# EAGLE design STX3NoAnt (EAGLE 6.5.0)
STX3 Satellite Transmitter Breakout Board This board allows for direct UART interface with the STX3 module through the standard 6-pin header. The transmitter corresponds using the standard AT command set.
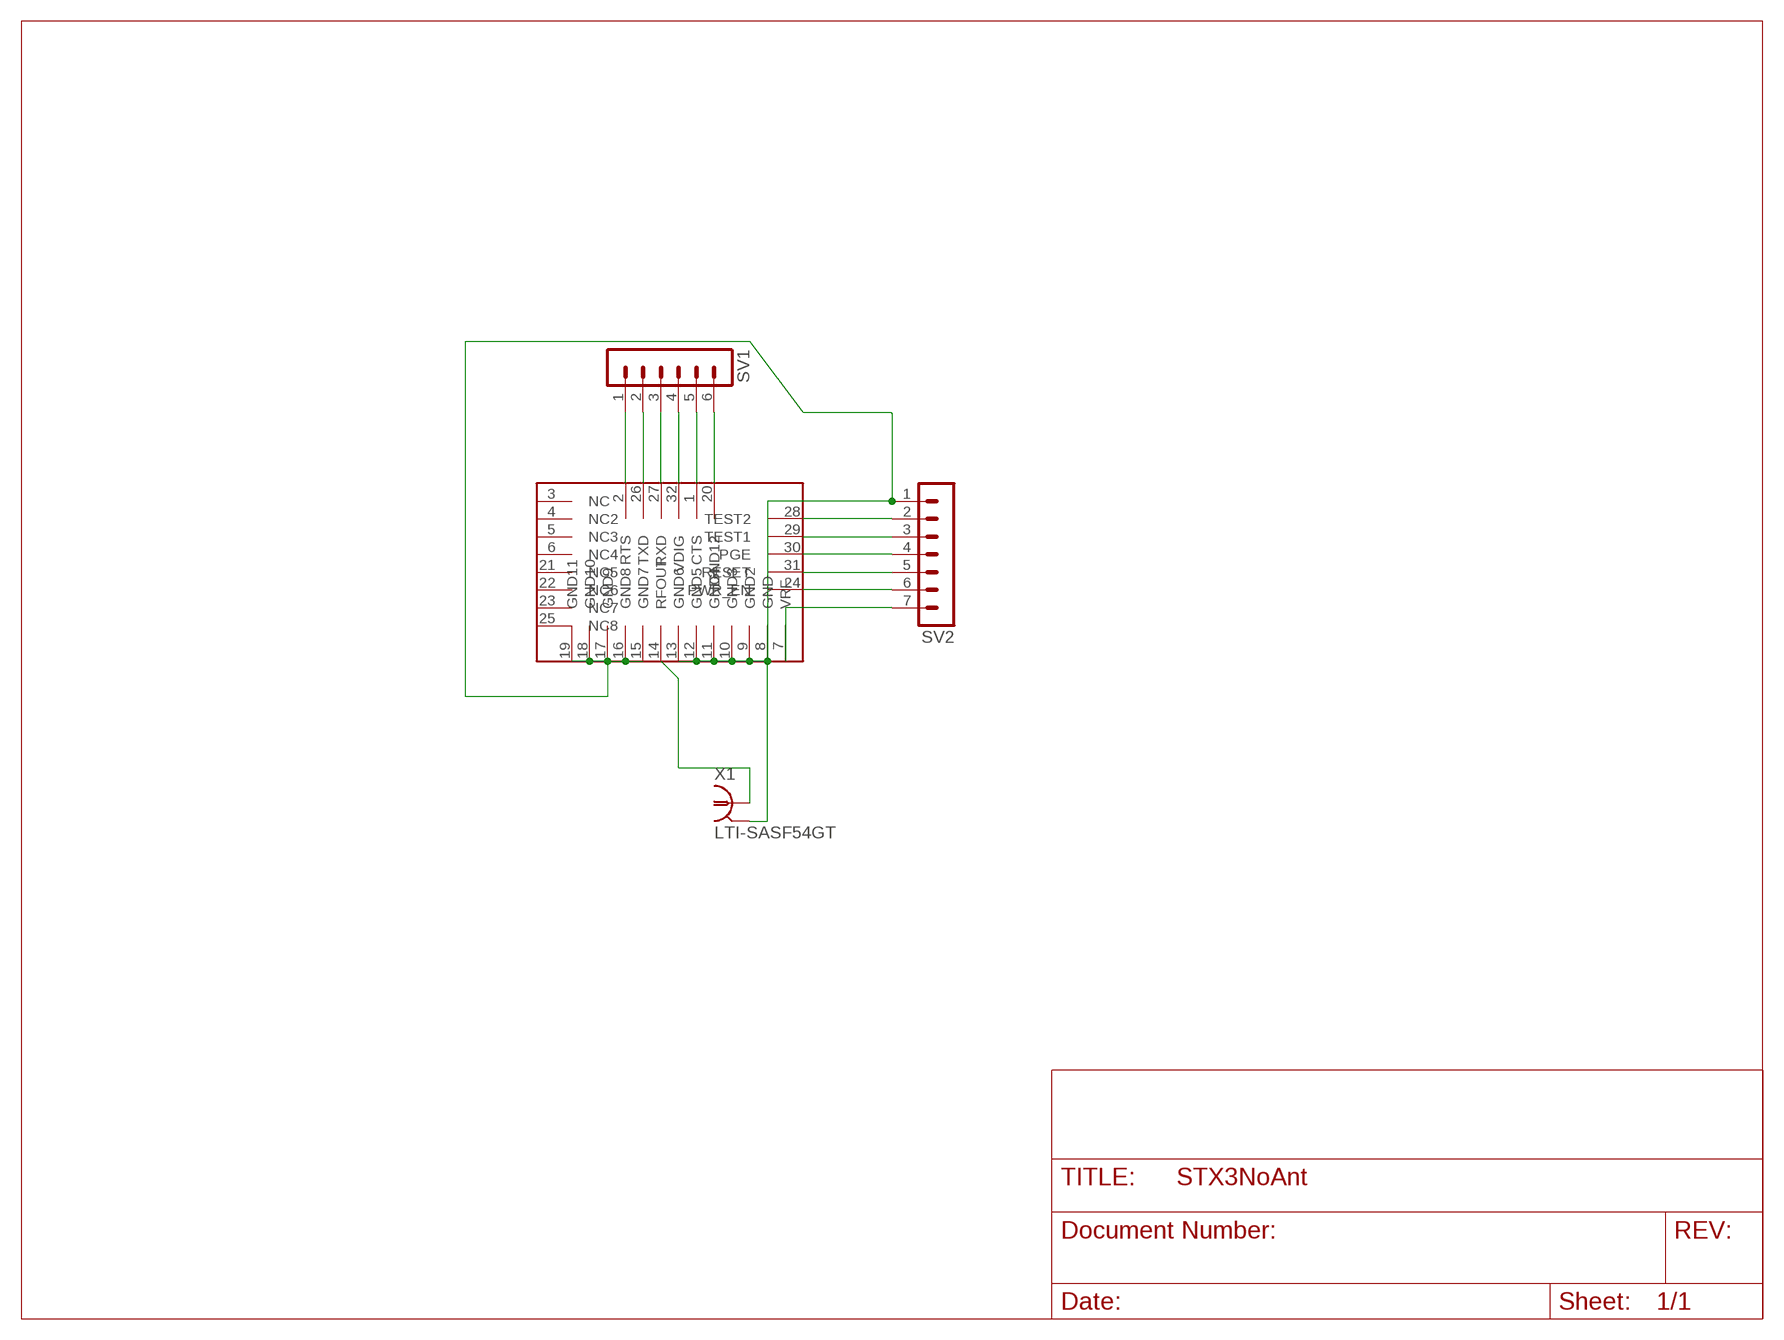
[diagram p0: schematic, sheet 1]

## Parts
SV1  MA06-1  [MA06-1]
SV2  MA07-1  [MA07-1]
U$1  STX3  [STX3]
X1  LTI-SASF54GT  [LTI-SASF54GT]

## Nets
N$1: SV1.4 U$1.32(VDIG)
N$2: SV1.2 U$1.26(TXD)
N$3: SV1.3 U$1.27(RXD)
N$4: SV1.1 U$1.2(RTS)
N$5: SV1.6 U$1.20(GND12)
N$6: SV2.2 U$1.28(TEST2)
N$7: SV1.5 U$1.1(CTS)
N$9: SV2.3 U$1.29(TEST1)
N$10: SV2.4 U$1.30(PGE)
N$11: SV2.5 U$1.31(RESET)
N$12: SV2.6 U$1.24(PWR_EN)
N$13: SV2.7 U$1.7(VRF)
N$14: SV2.1 U$1.8(GND) U$1.9(GND2) U$1.10(GND3) U$1.11(GND4) U$1.12(GND5) U$1.13(GND6) U$1.15(GND7) U$1.16(GND8) U$1.17(GND9) U$1.18(GND10) U$1.19(GND11) X1.2 X1.3 X1.4 X1.5
N$15: U$1.14(RFOUT) X1.1
Unconnected: U$1.3(NC) U$1.4(NC2) U$1.5(NC3) U$1.6(NC4) U$1.21(NC5) U$1.22(NC6) U$1.23(NC7) U$1.25(NC8)

## Library data of the parts
SV1 = con-lstb:MA06-1: PIN HEADER; OC_FARNELL: unknown; OC_NEWARK: unknown
SV2 = con-lstb:MA07-1: PIN HEADER; OC_FARNELL: unknown; OC_NEWARK: unknown
U$1 = STX3:STX3: GlobalStar STX3 Satellite Transmitter Module
X1 = con-coax:LTI-SASF54GT: SMA vertical PCB thrue hole jack Source: Lighthorse Technologies, inc. SASF54GT.pdf; OC_FARNELL: unknown; OC_NEWARK: unknown

## Board
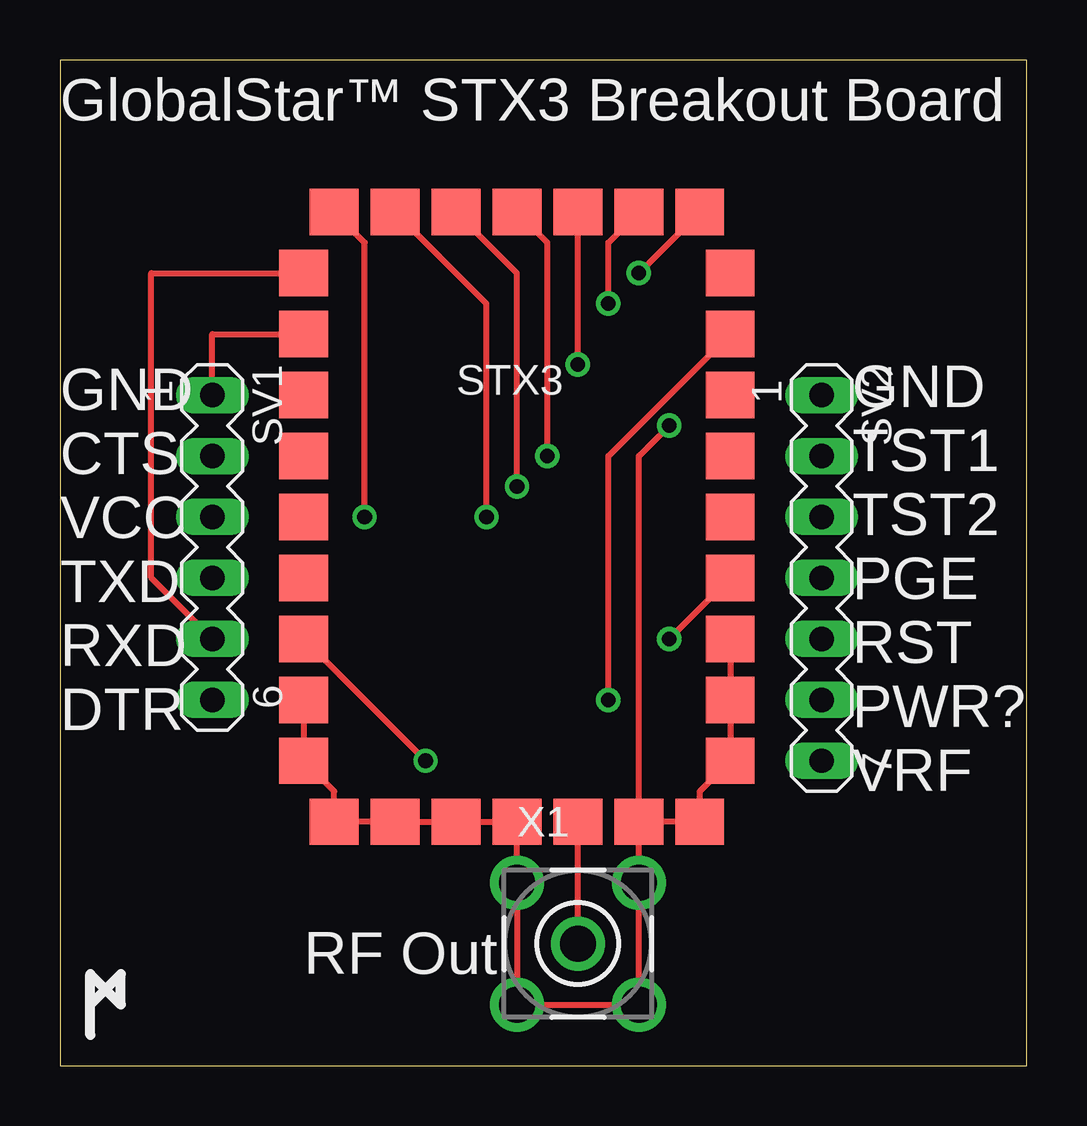
[diagram p1: board, top side]
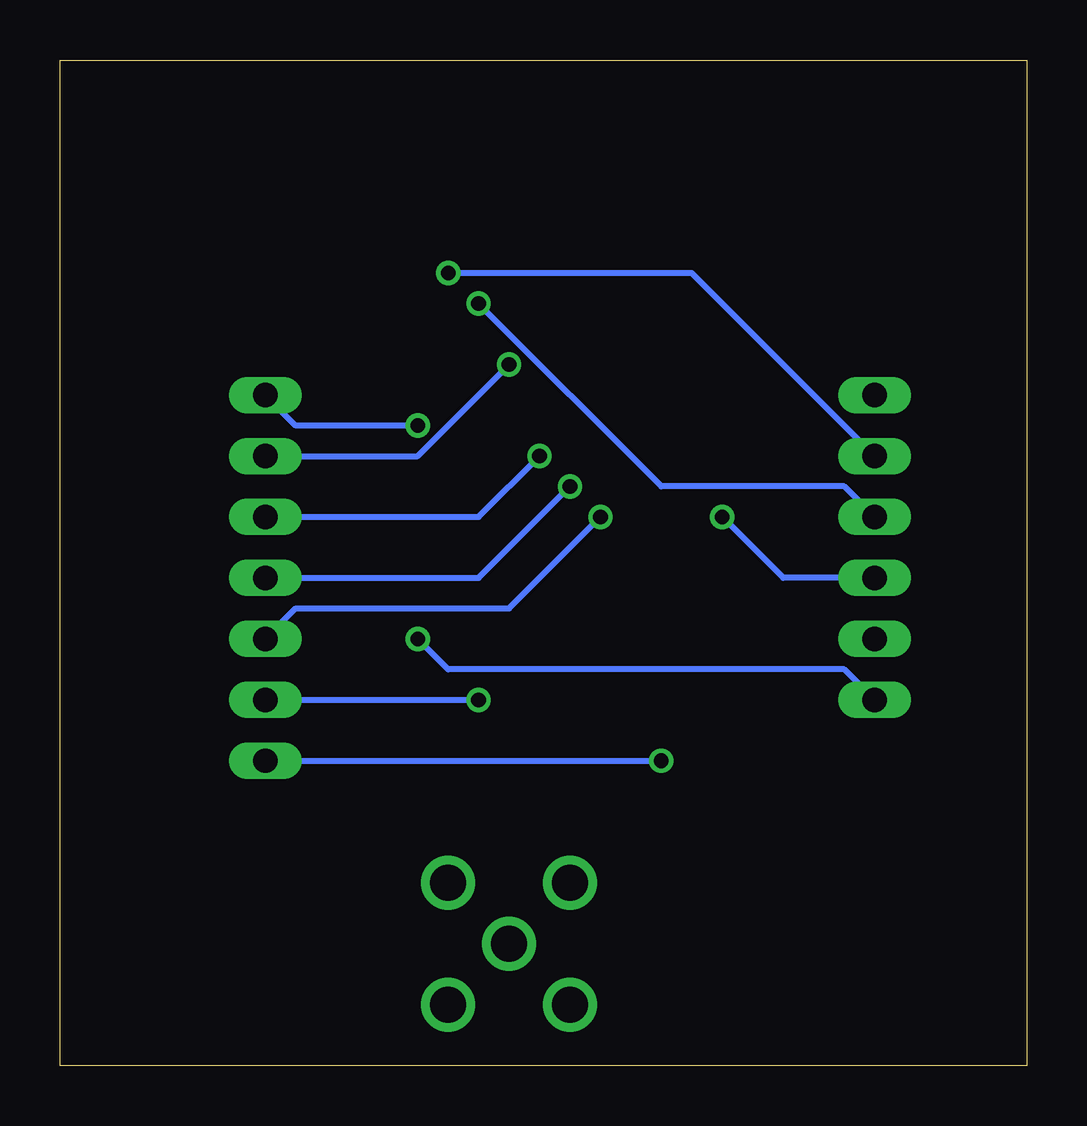
[diagram p2: board, bottom side, seen from below]

Size 40.31 x 41.9 mm. Coordinates in mm from the lower left corner, seen from the top.
Outline: 0,0 40.31,0 40.31,41.9 0,41.9 0,0
Copper layers (1*16): Top 0.035mm / dielectric 1.5mm / Bottom 0.035mm
Design rules "default": minimum track width 10mil, minimum drill 24mil, track to track 8mil, track to pad 8mil, pad to pad 8mil, via to via 8mil, smd to smd 8mil, copper to edge 40mil, drill to drill 8mil, minimum pad ring 10mil, minimum via ring 8mil, stop-mask expansion 4mil, vias tented up to drill 0mil, thermal gap 10mil

### Footprints (pad centres in the part's own frame; a part is rotated, then mirrored left to right if it is on the bottom)
MA06-1 = drill 1.016 long: 1 -6.35,0; 2 -3.81,0; 3 -1.27,0; 4 1.27,0; 5 3.81,0; 6 6.35,0
MA07-1 = drill 1.016 long: 1 -7.62,0; 2 -5.08,0; 3 -2.54,0; 4 0,0; 5 2.54,0; 6 5.08,0; 7 7.62,0
STX3 = smd 2.032 x 1.93: 1 -8.89,10.16; 2 -8.89,7.62; 3 -8.89,5.08; 4 -8.89,2.54; 5 -8.89,0; 6 -8.89,-2.54; 7 -8.89,-5.08; 8 -8.89,-7.62; 9 -8.89,-10.16; 10 -7.62,-12.7; 11 -5.08,-12.7; 12 -2.54,-12.7; 13 0,-12.7; 14 2.54,-12.7; 15 5.08,-12.7; 16 7.62,-12.7; 17 8.89,-10.16; 18 8.89,-7.62; 19 8.89,-5.08; 20 8.89,-2.54; 21 8.89,0; 22 8.89,2.54; 23 8.89,5.08; 24 8.89,7.62; 25 8.89,10.16; 26 7.62,12.7; 27 5.08,12.7; 28 2.54,12.7; 29 0,12.7; 30 -2.54,12.7; 31 -5.08,12.7; 32 -7.62,12.7
LTI-SASF54GT = drill 1.5 pad 2.2: 1 0,0; 2 -2.54,2.54; 3 2.54,2.54; 4 2.54,-2.54; 5 -2.54,-2.54

### Placement (x,y rotation side)
SV1  6.35,21.59 270 top
SV2  31.75,20.32 270 top
U$1  19.05,22.86 0 top
X1  21.59,5.08 0 top

### Tracks (layer width: path | path; a pad name or v marks a point on that pad's centre or on a via)
N$1  (via drill 0.61)
  Top 0.254: U$1.32 12.7,34.29 v12.7,22.86
  Bottom 0.254: v12.7,22.86 10.16,20.32 SV1.4
N$2  (via drill 0.61)
  Top 0.254: v24.13,33.02 U$1.26
  Bottom 0.254: v24.13,33.02 13.97,33.02 SV1.2
N$3  (via drill 0.61)
  Top 0.254: U$1.27 22.86,34.29 v22.86,31.75
  Bottom 0.254: v22.86,31.75 15.24,24.13 7.62,24.13 SV1.3
N$4
  Top 0.254: U$1.2 6.35,30.48 SV1.1
N$5  (via drill 0.61)
  Top 0.254: v25.4,17.78 U$1.20
  Bottom 0.254: v25.4,17.78 24.13,16.51 7.62,16.51 SV1.6
N$6  (via drill 0.61)
  Top 0.254: v21.59,29.21 U$1.28
  Bottom 0.254: v21.59,29.21 25.4,25.4 SV2.2
N$7
  Top 0.254: U$1.1 3.81,33.02 3.81,20.32 SV1.5
N$9  (via drill 0.61)
  Top 0.254: U$1.29 20.32,34.29 v20.32,25.4
  Bottom 0.254: v20.32,25.4 22.86,22.86 SV2.3
N$10  (via drill 0.61)
  Top 0.254: U$1.30 19.05,33.02 v19.05,24.13
  Bottom 0.254: v19.05,24.13 22.86,20.32 SV2.4
N$11  (via drill 0.61)
  Top 0.254: U$1.31 17.78,31.75 v17.78,22.86
  Bottom 0.254: v17.78,22.86 21.59,19.05 30.48,19.05 SV2.5
N$12  (via drill 0.61)
  Top 0.254: U$1.24 22.86,25.4 v22.86,15.24
  Bottom 0.254: SV2.6 v22.86,15.24
N$13  (via drill 0.61)
  Top 0.254: v15.24,12.7 U$1.7
  Bottom 0.254: SV2.7 v15.24,12.7
N$14  (via drill 0.61)
  Top 0.254: U$1.19 U$1.18 U$1.17 26.67,11.43 U$1.16 U$1.15 | U$1.15 X1.3 X1.4 X1.5 X1.2 U$1.13 U$1.12 U$1.11 U$1.10 11.43,11.43 U$1.9 U$1.8 | v25.4,26.67 24.13,25.4 U$1.15
  Bottom 0.254: SV2.1 30.48,26.67 v25.4,26.67
N$15
  Top 0.254: X1.1 U$1.14

### Text on the board
tPlace: GlobalStar™ STX3 Breakout Board | GND / CTS / VCC / TXD / RXD / DTR | GND / TST1 / TST2 / PGE / RST / PWR? / VRF | RF Out